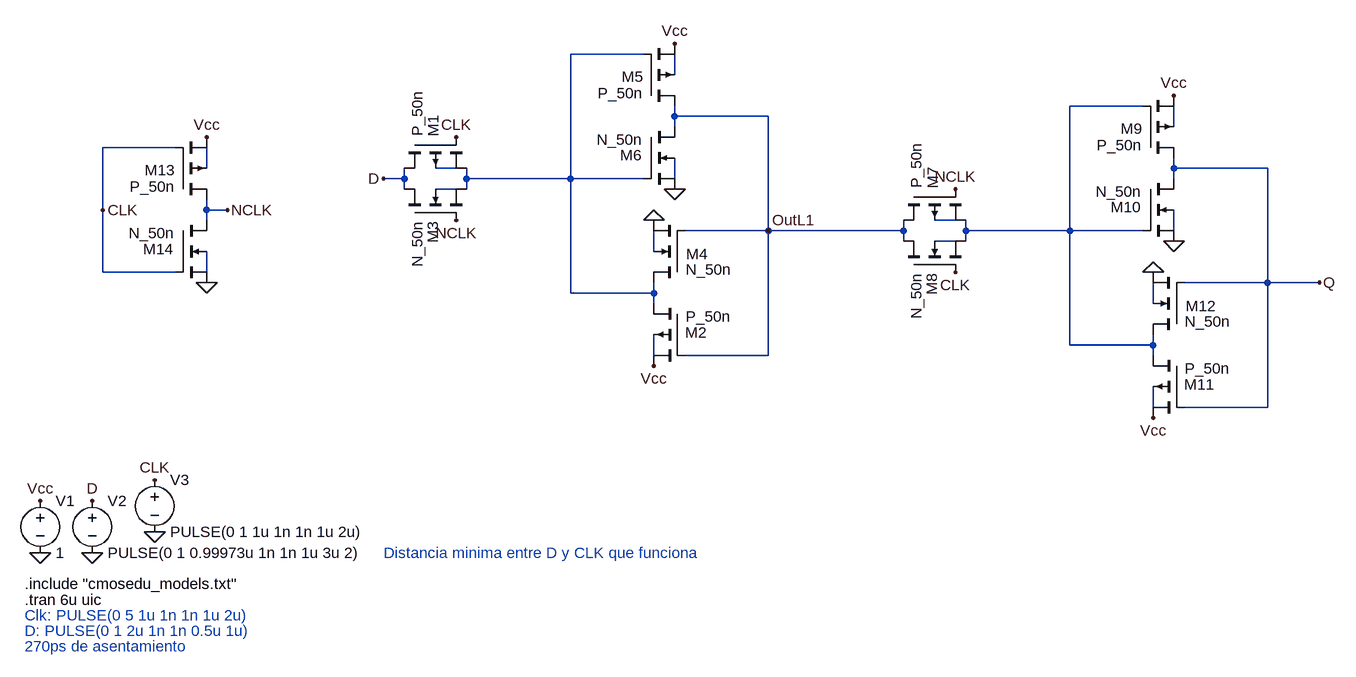
[diagram p0: schematic 1_TiempoDeAsentamiento.asc]
1_TiempoDeAsentamiento.asc, the LTspice schematic file:
Version 4
SHEET 1 2692 680
WIRE 1440 -336 1328 -336
WIRE 1488 -304 1488 -336
WIRE 2208 -256 2096 -256
WIRE 1488 -240 1488 -256
WIRE 1632 -240 1488 -240
WIRE 1488 -224 1488 -240
WIRE 2256 -224 2256 -256
WIRE 720 -192 608 -192
WIRE 768 -160 768 -192
WIRE 1152 -160 1120 -160
WIRE 2256 -160 2256 -176
WIRE 2400 -160 2256 -160
WIRE 1072 -144 1072 -160
WIRE 1072 -144 1040 -144
WIRE 1168 -144 1168 -160
WIRE 1328 -144 1328 -336
WIRE 1328 -144 1168 -144
WIRE 1440 -144 1328 -144
WIRE 1488 -144 1488 -176
WIRE 2256 -144 2256 -160
WIRE 1072 -128 1072 -144
WIRE 1152 -128 1120 -128
WIRE 1168 -128 1168 -144
WIRE 608 -96 608 -192
WIRE 768 -96 768 -112
WIRE 800 -96 768 -96
WIRE 768 -80 768 -96
WIRE 1920 -80 1888 -80
WIRE 1632 -64 1632 -240
WIRE 1632 -64 1504 -64
WIRE 1840 -64 1840 -80
WIRE 1840 -64 1632 -64
WIRE 1936 -64 1936 -80
WIRE 2096 -64 2096 -256
WIRE 2096 -64 1936 -64
WIRE 2208 -64 2096 -64
WIRE 2256 -64 2256 -96
WIRE 1840 -48 1840 -64
WIRE 1920 -48 1888 -48
WIRE 1936 -48 1936 -64
WIRE 1456 -32 1456 -64
WIRE 608 0 608 -96
WIRE 720 0 608 0
WIRE 768 0 768 -32
WIRE 2400 16 2400 -160
WIRE 2400 16 2272 16
WIRE 2480 16 2400 16
WIRE 1328 32 1328 -144
WIRE 1456 32 1456 16
WIRE 1456 32 1328 32
WIRE 1456 48 1456 32
WIRE 2224 48 2224 16
WIRE 2096 112 2096 -64
WIRE 2224 112 2224 96
WIRE 2224 112 2096 112
WIRE 1456 128 1456 96
WIRE 1632 128 1632 -64
WIRE 1632 128 1504 128
WIRE 2224 128 2224 112
WIRE 2224 208 2224 176
WIRE 2400 208 2400 16
WIRE 2400 208 2272 208
FLAG 592 432 0
FLAG 592 352 D
FLAG 1040 -144 D
FLAG 688 400 0
FLAG 688 320 CLK
FLAG 1152 -208 CLK
FLAG 1152 -80 NCLK
FLAG 512 432 0
FLAG 512 352 Vcc
FLAG 1488 -128 0
FLAG 1488 -352 Vcc
FLAG 1456 -80 0
FLAG 1456 144 Vcc
FLAG 1632 -64 OutL1
FLAG 1920 -128 NCLK
FLAG 2256 -48 0
FLAG 2256 -272 Vcc
FLAG 2224 0 0
FLAG 2224 224 Vcc
FLAG 1920 0 CLK
FLAG 2480 16 Q
FLAG 768 16 0
FLAG 768 -208 Vcc
FLAG 800 -96 NCLK
FLAG 608 -96 CLK
SYMBOL pmos4 1072 -208 M90
WINDOW 0 0 45 Right 2
WINDOW 3 -1 20 Right 2
SYMATTR InstName M1
SYMATTR Value P_50n
SYMATTR Value2 l=50n w=1200n
SYMBOL nmos4 1072 -80 R270
WINDOW 0 -2 44 Right 2
WINDOW 3 -1 20 Right 2
SYMATTR InstName M3
SYMATTR Value N_50n
SYMATTR Value2 l=50n w=800n
SYMBOL voltage 592 336 R0
WINDOW 123 0 0 Left 0
WINDOW 39 0 0 Left 0
SYMATTR InstName V2
SYMATTR Value PULSE(0 1 0.99973u 1n 1n 1u 3u 2)
SYMBOL voltage 688 304 R0
WINDOW 123 0 0 Left 0
WINDOW 39 0 0 Left 0
SYMATTR InstName V3
SYMATTR Value PULSE(0 1 1u 1n 1n 1u 2u)
SYMBOL voltage 512 336 R0
WINDOW 123 0 0 Left 0
WINDOW 39 0 0 Left 0
SYMATTR InstName V1
SYMATTR Value 1
SYMBOL pmos4 1440 -256 M180
WINDOW 0 0 45 Right 2
WINDOW 3 -1 20 Right 2
SYMATTR InstName M5
SYMATTR Value P_50n
SYMATTR Value2 l=50n w=1200n
SYMBOL nmos4 1440 -224 R0
WINDOW 0 -2 44 Right 2
WINDOW 3 -1 20 Right 2
SYMATTR InstName M6
SYMATTR Value N_50n
SYMATTR Value2 l=50n w=800n
SYMBOL pmos4 1504 48 M0
WINDOW 0 0 45 Right 2
WINDOW 3 -1 20 Right 2
SYMATTR InstName M2
SYMATTR Value P_50n
SYMATTR Value2 l=50n w=300n
SYMBOL nmos4 1504 16 R180
WINDOW 0 -2 44 Right 2
WINDOW 3 -1 20 Right 2
SYMATTR InstName M4
SYMATTR Value N_50n
SYMATTR Value2 l=50n w=200n
SYMBOL pmos4 1840 -128 M90
WINDOW 0 0 45 Right 2
WINDOW 3 -1 20 Right 2
SYMATTR InstName M7
SYMATTR Value P_50n
SYMATTR Value2 l=50n w=1200n
SYMBOL nmos4 1840 0 R270
WINDOW 0 -2 44 Right 2
WINDOW 3 -1 20 Right 2
SYMATTR InstName M8
SYMATTR Value N_50n
SYMATTR Value2 l=50n w=800n
SYMBOL pmos4 2208 -176 M180
WINDOW 0 0 45 Right 2
WINDOW 3 -1 20 Right 2
SYMATTR InstName M9
SYMATTR Value P_50n
SYMATTR Value2 l=50n w=1200n
SYMBOL nmos4 2208 -144 R0
WINDOW 0 -2 44 Right 2
WINDOW 3 -1 20 Right 2
SYMATTR InstName M10
SYMATTR Value N_50n
SYMATTR Value2 l=50n w=800n
SYMBOL pmos4 2272 128 M0
WINDOW 0 0 45 Right 2
WINDOW 3 -1 20 Right 2
SYMATTR InstName M11
SYMATTR Value P_50n
SYMATTR Value2 l=50n w=300n
SYMBOL nmos4 2272 96 R180
WINDOW 0 -2 44 Right 2
WINDOW 3 -1 20 Right 2
SYMATTR InstName M12
SYMATTR Value N_50n
SYMATTR Value2 l=50n w=200n
SYMBOL pmos4 720 -112 M180
WINDOW 0 0 45 Right 2
WINDOW 3 -1 20 Right 2
SYMATTR InstName M13
SYMATTR Value P_50n
SYMATTR Value2 l=50n w=1200n
SYMBOL nmos4 720 -80 R0
WINDOW 0 -2 44 Right 2
WINDOW 3 -1 20 Right 2
SYMATTR InstName M14
SYMATTR Value N_50n
SYMATTR Value2 l=50n w=800n
TEXT 488 480 Left 2 !.include "cmosedu_models.txt"
TEXT 488 528 Left 2 ;Clk: PULSE(0 5 1u 1n 1n 1u 2u)
TEXT 488 504 Left 2 !.tran 6u uic
TEXT 488 552 Left 2 ;D: PULSE(0 1 2u 1n 1n 0.5u 1u)
TEXT 1040 432 Left 2 ;Distancia minima entre D y CLK que funciona
TEXT 488 576 Left 2 ;270ps de asentamiento

The netlist it stands for:
* 1_TiempoDeAsentamiento.asc
M1 D CLK N001 N006 P_50n l=50n w=1200n
M3 D NCLK N001 N008 N_50n l=50n w=800n
V2 D 0 PULSE(0 1 0.99973u 1n 1n 1u 3u 2)
V3 CLK 0 PULSE(0 1 1u 1n 1n 1u 2u)
V1 Vcc 0 1
M5 OutL1 N001 Vcc N002 P_50n l=50n w=1200n
M6 OutL1 N001 0 N007 N_50n l=50n w=800n
M2 N001 OutL1 Vcc N015 P_50n l=50n w=300n
M4 N001 OutL1 0 N012 N_50n l=50n w=200n
M7 OutL1 NCLK N003 N009 P_50n l=50n w=1200n
M8 OutL1 CLK N003 N011 N_50n l=50n w=800n
M9 Q N003 Vcc N004 P_50n l=50n w=1200n
M10 Q N003 0 N010 N_50n l=50n w=800n
M11 N003 Q Vcc N016 P_50n l=50n w=300n
M12 N003 Q 0 N014 N_50n l=50n w=200n
M13 NCLK CLK Vcc N005 P_50n l=50n w=1200n
M14 NCLK CLK 0 N013 N_50n l=50n w=800n
.model NMOS NMOS
.model PMOS PMOS
.lib standard.mos
.include "cmosedu_models.txt"
* Clk: PULSE(0 5 1u 1n 1n 1u 2u)
.tran 6u uic
* D: PULSE(0 1 2u 1n 1n 0.5u 1u)
* Distancia minima entre D y CLK que funciona
* 270ps de asentamiento
.backanno
.end